# EAGLE design uJOVE7 (EAGLE 9.4.2)

## Sheet 1 of 2
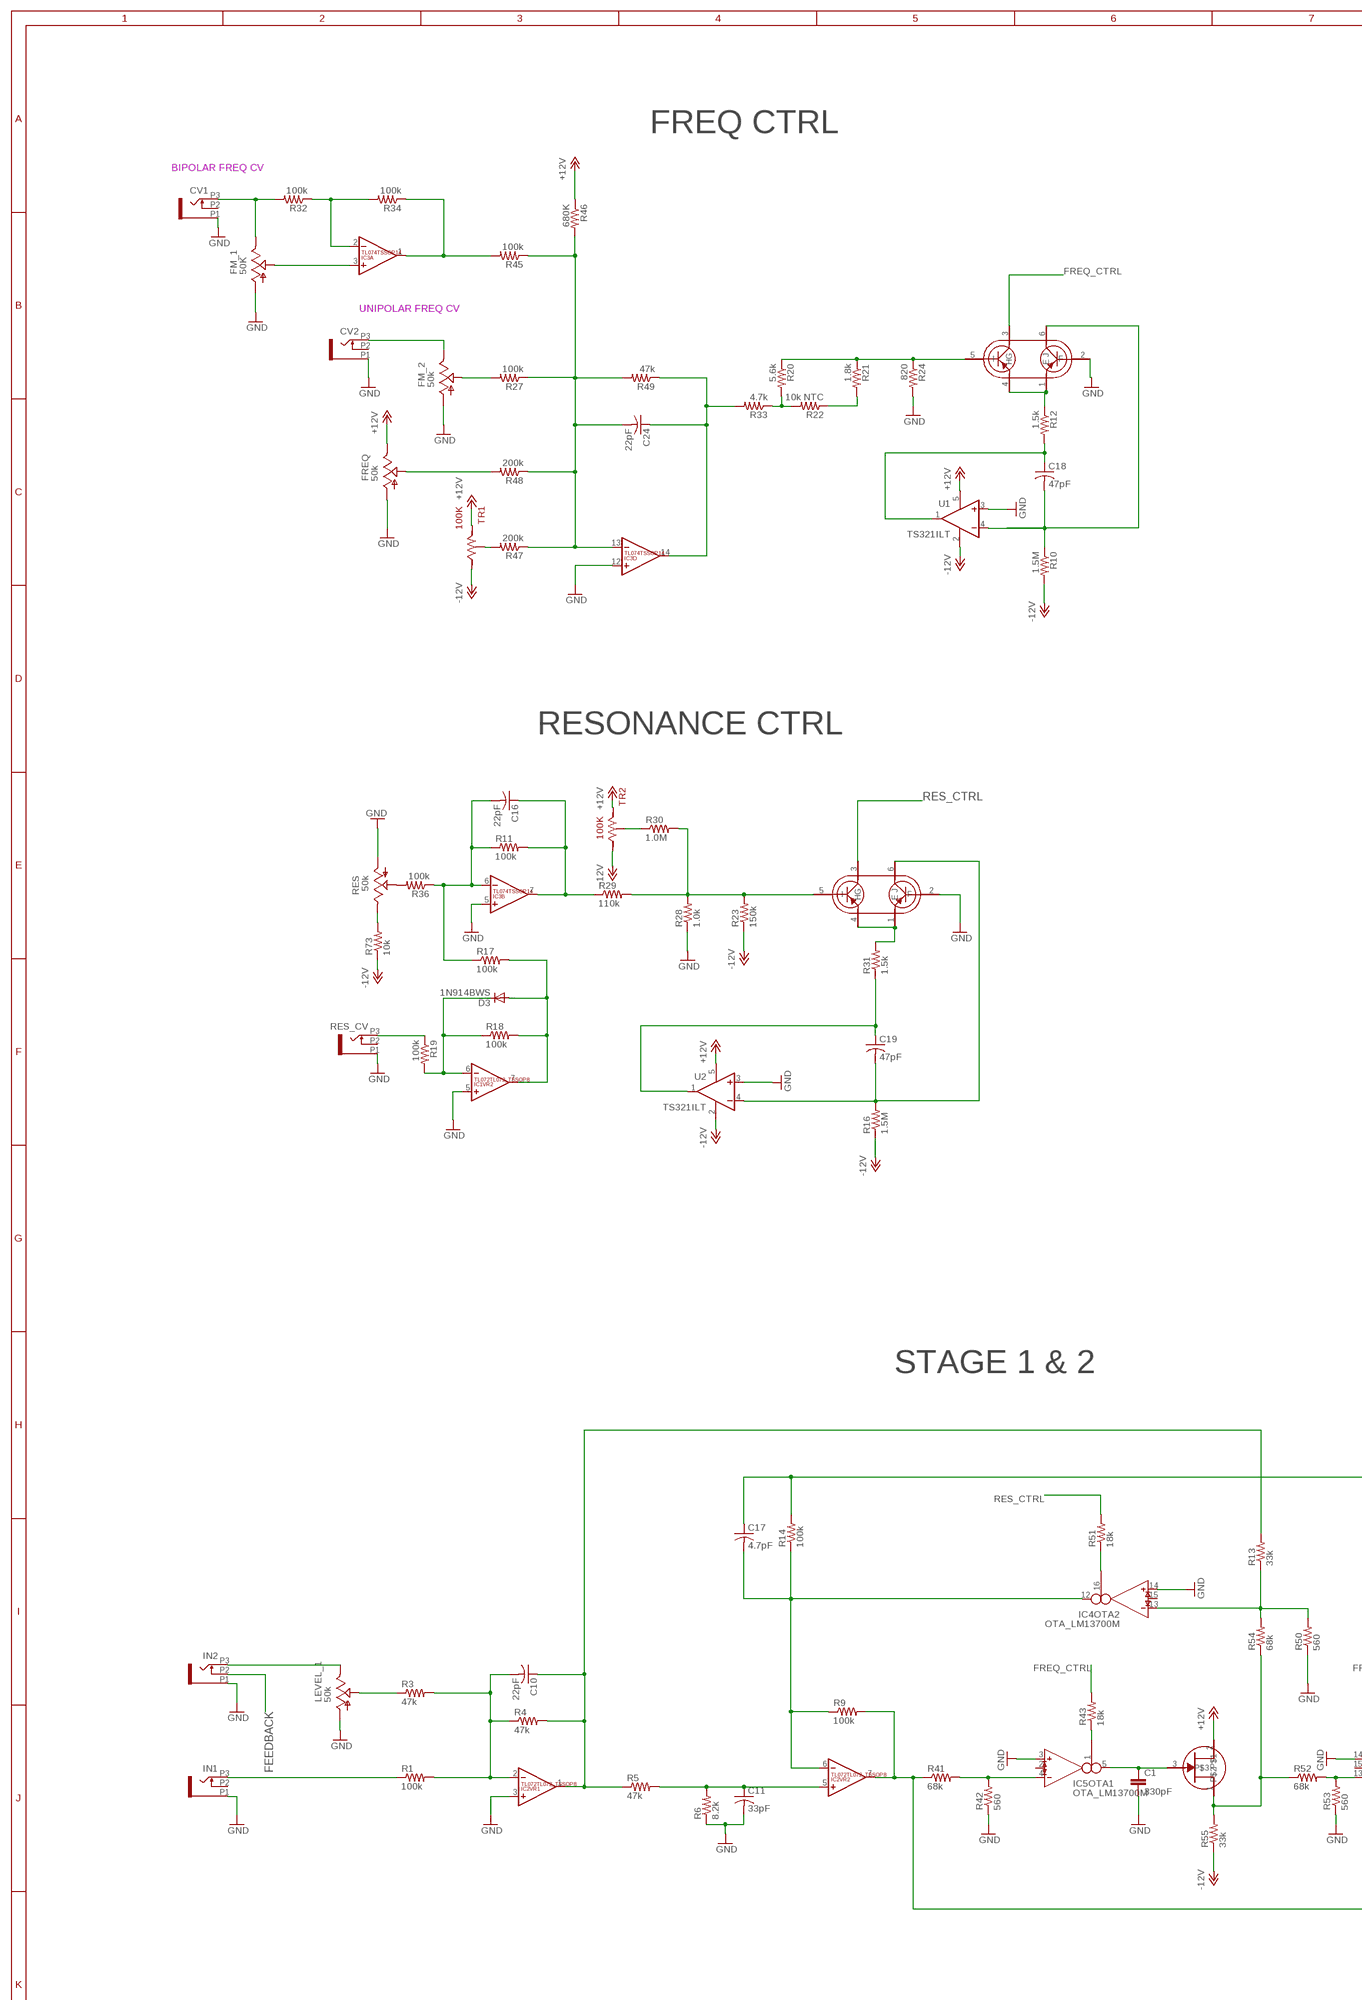
[diagram p0: schematic, sheet 1, part 1 of 3]
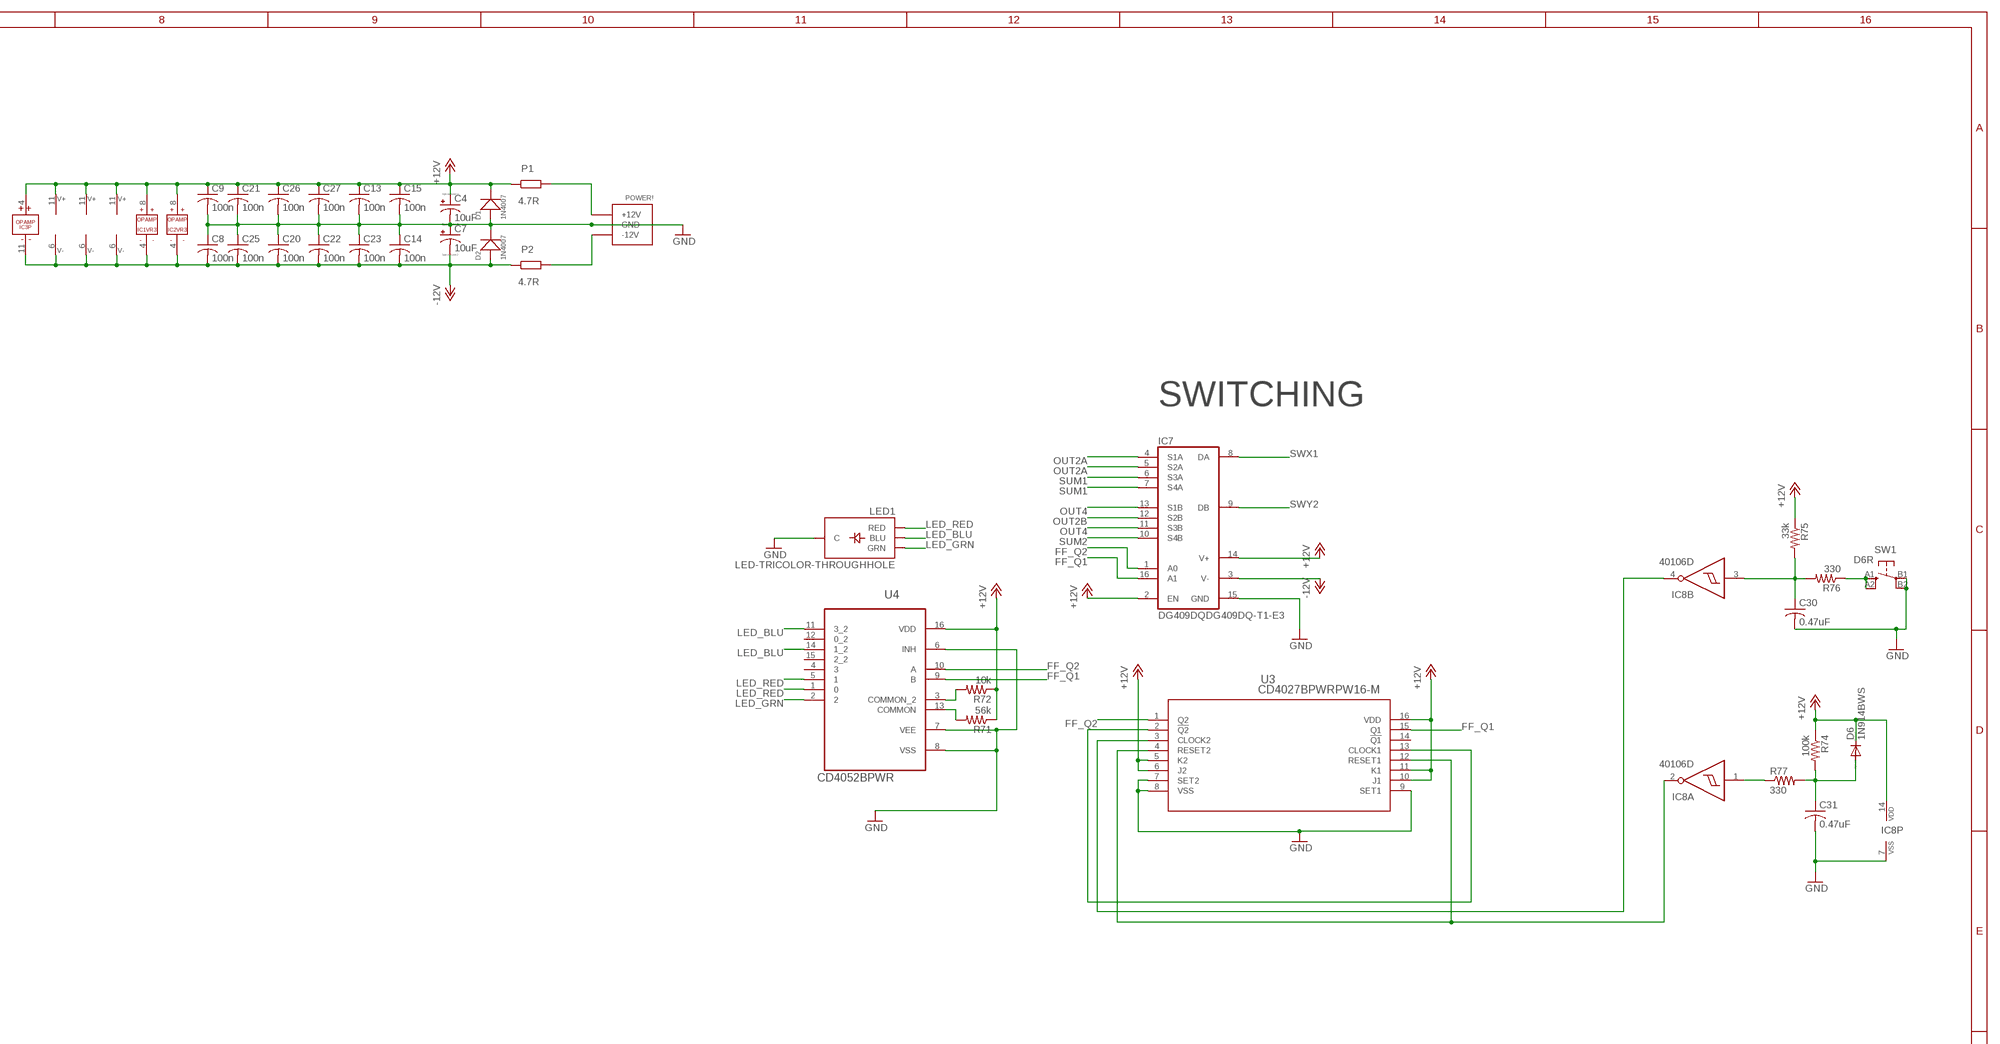
[diagram p1: schematic, sheet 1, part 2 of 3]
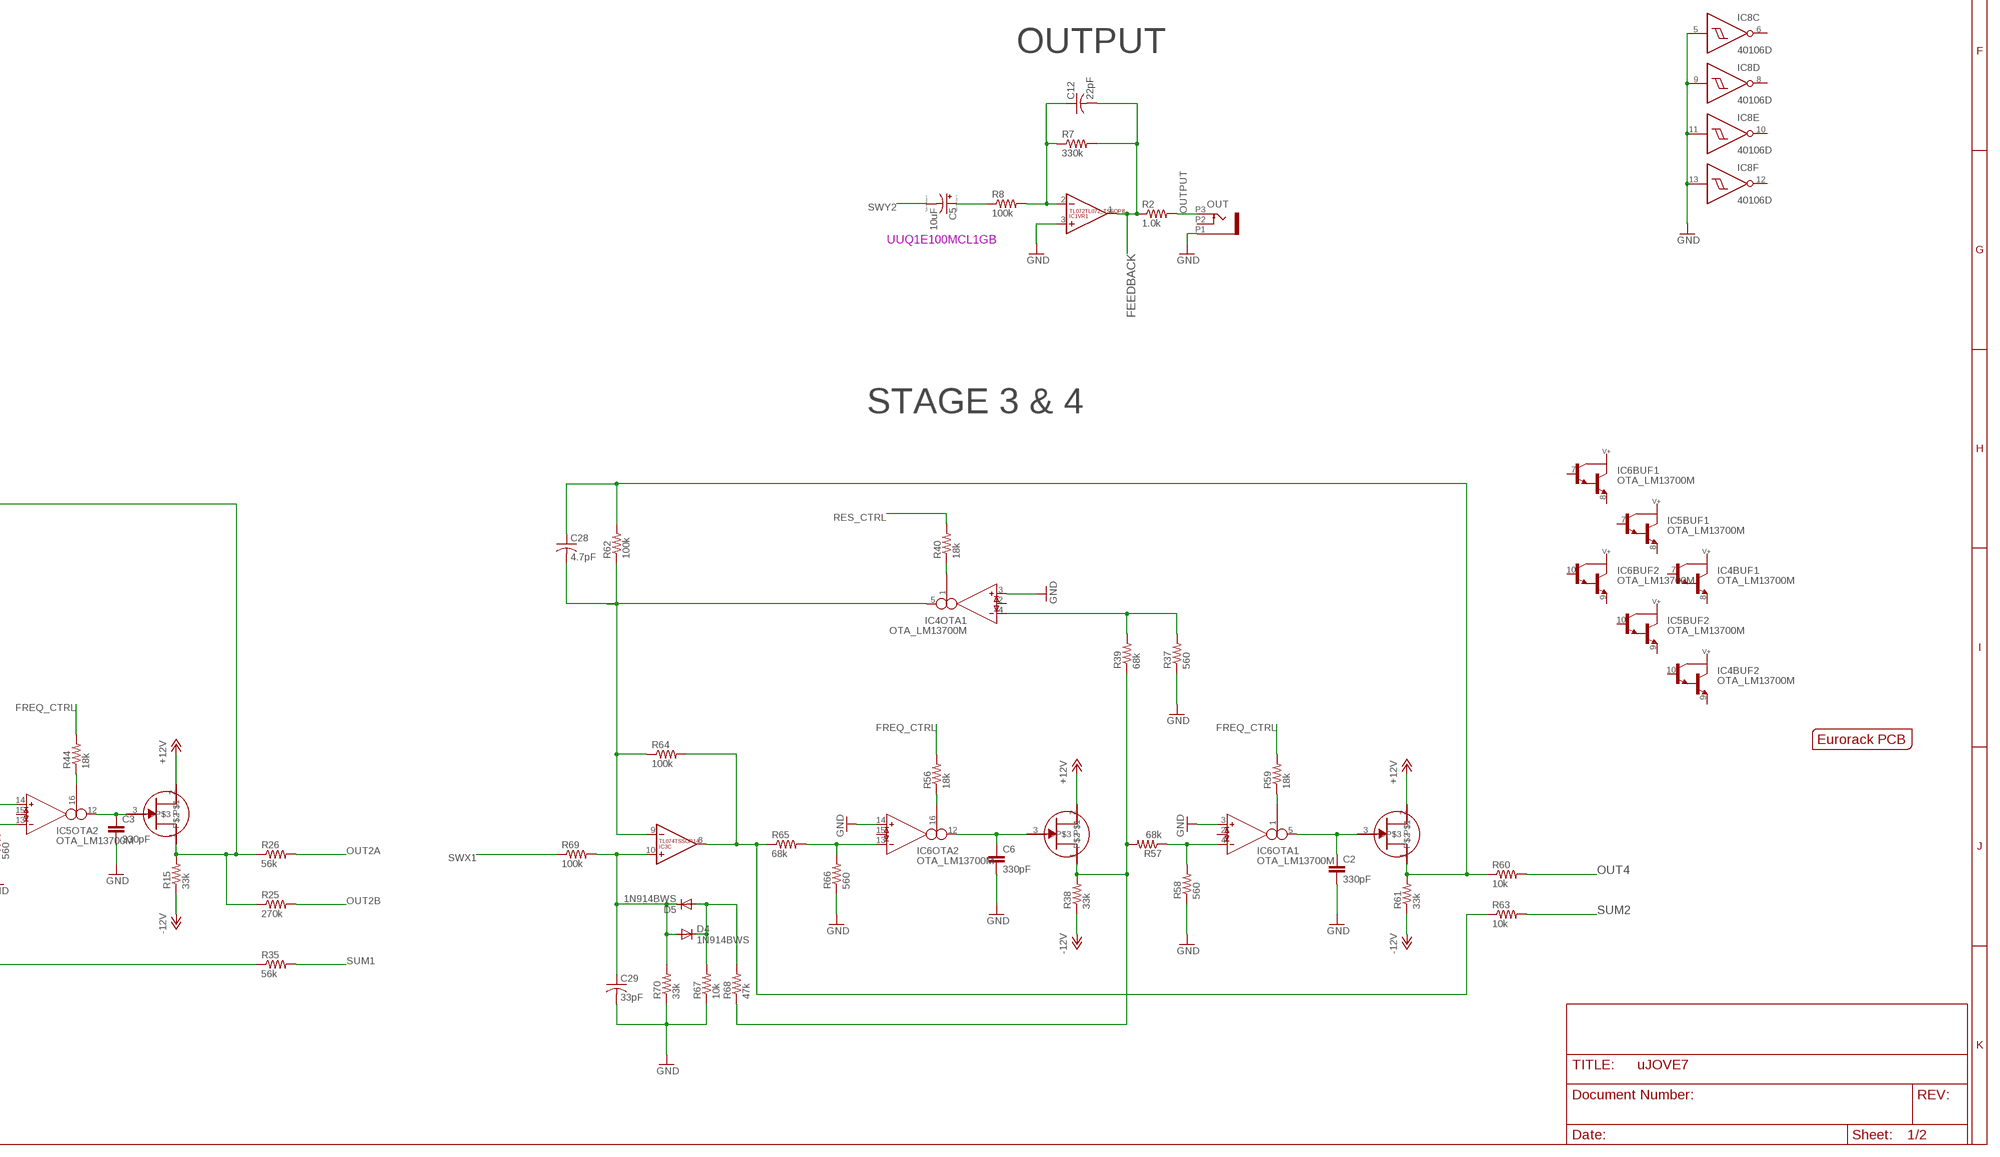
[diagram p2: schematic, sheet 1, part 3 of 3]

### Parts
C1  330pF  C5/5  [C5B5]
C2  330pF  C5/5  [C5B5]
C3  330pF  C5/5  [C5B5]
C4  10uF  CPOL-USC  [PANASONIC_C]
C5  10uF  CPOL-USC  [PANASONIC_C]
C6  330pF  C5/5  [C5B5]
C7  10uF  CPOL-USC  [PANASONIC_C]
C8  100n  C-USC0603  [C0603]
C9  100n  C-USC0603  [C0603]
C10  22pF  C-USC0603  [C0603]
C11  33pF  C-USC0603  [C0603]
C12  22pF  C-USC0603  [C0603]
C13  100n  C-USC0603  [C0603]
C14  100n  C-USC0603  [C0603]
C15  100n  C-USC0603  [C0603]
C16  22pF  C-USC0603  [C0603]
C17  4.7pF  C-USC0603  [C0603]
C18  47pF  C-USC0603  [C0603]
C19  47pF  C-USC0603  [C0603]
C20  100n  C-USC0603  [C0603]
C21  100n  C-USC0603  [C0603]
C22  100n  C-USC0603  [C0603]
C23  100n  C-USC0603  [C0603]
C24  22pF  C-USC0603  [C0603]
C25  100n  C-USC0603  [C0603]
C26  100n  C-USC0603  [C0603]
C27  100n  C-USC0603  [C0603]
C28  4.7pF  C-USC0603  [C0603]
C29  33pF  C-USC0603  [C0603]
C30  0.47uF  C-USC0603  [C0603]
C31  0.47uF  C-USC0603  [C0603]
CV1  OG-PJ301_PJ301_THONKICONN  [OG-PJ301_WQP_PJ_301M6_NO_HOLE]
CV2  OG-PJ301_PJ301_THONKICONN  [OG-PJ301_WQP_PJ_301M6_NO_HOLE]
D1  1N4007  DIODE-GEN-PURPOSE-1KV-1A(DO-214AC)  [DO-214AC]
D2  1N4007  DIODE-GEN-PURPOSE-1KV-1A(DO-214AC)  [DO-214AC]
D3  1N914BWS  DIODE-SOD323-R  [SOD323-R]
D4  1N914BWS  DIODE-SOD323-R  [SOD323-R]
D5  1N914BWS  DIODE-SOD323-R  [SOD323-R]
D6  1N914BWS  DIODE-SOD323-R  [SOD323-R]
FM_1  50K  OG-POTS_POT_USVERTICAL  [OG-POTS_ALPS_POT_VERTICAL]
FM_2  50k  OG-POTS_POT_USVERTICAL  [OG-POTS_ALPS_POT_VERTICAL]
FREQ  50k  OG-POTS_POT_USVERTICAL_PS  [OG-POTS_ALPS_POT_VERTICAL_PS]
IC1  TL072TL072_TSSOP8  [TL072_TSSOP8]
IC2  TL072TL072_TSSOP8  [TL072_TSSOP8]
IC3  TL074TSSOP14  [TSSOP14]
IC4  OTA_LM13700M  [OTA_SO16]
IC5  OTA_LM13700M  [OTA_SO16]
IC6  OTA_LM13700M  [OTA_SO16]
IC7  DG409DQDG409DQ-T1-E3  [TSSOP16]
IC8  40106D  [SO14]
IN1  OG-PJ301_PJ301_THONKICONN  [OG-PJ301_WQP_PJ_301M6_NO_HOLE]
IN2  OG-PJ301_PJ301_THONKICONN  [OG-PJ301_WQP_PJ_301M6_NO_HOLE]
LED1  LED-TRICOLOR-THROUGHHOLE  [LED-TRICOLOR-THROUGHHOLE]
LEVEL_1  50k  OG-POTS_POT_USVERTICAL  [OG-POTS_ALPS_POT_VERTICAL]
OUT  OG-PJ301_PJ301_THONKICONN  [OG-PJ301_WQP_PJ_301M6_NO_HOLE]
P1  4.7R  R-EU_R1206  [R1206]
P2  4.7R  R-EU_R1206  [R1206]
PCB1  EURORACK_PCB  [EURORACK8HPPCB-S]
POWER!  POWER_SIMPLE  [2X05_SMT_HEADER]
Q1  BCM857BS  [SOT65P210X110-6N]
Q2  BCM857BS  [SOT65P210X110-6N]
Q3  MMBFJ112MMBFJ112  [SOT23]
Q4  MMBFJ112MMBFJ112  [SOT23]
Q5  MMBFJ112MMBFJ112  [SOT23]
Q6  MMBFJ112MMBFJ112  [SOT23]
R1  100k  R-US_R0603  [R0603]
R2  1.0k  R-US_R0603  [R0603]
R3  47k  R-US_R0603  [R0603]
R4  47k  R-US_R0603  [R0603]
R5  47k  R-US_R0603  [R0603]
R6  8.2k  R-US_R0603  [R0603]
R7  330k  R-US_R0603  [R0603]
R8  100k  R-US_R0603  [R0603]
R9  100k  R-US_R0603  [R0603]
R10  1.5M  R-US_R0603  [R0603]
R11  100k  R-US_R0603  [R0603]
R12  1.5k  R-US_R0603  [R0603]
R13  33k  R-US_R0603  [R0603]
R14  100k  R-US_R0603  [R0603]
R15  33k  R-US_R0603  [R0603]
R16  1.5M  R-US_R0603  [R0603]
R17  100k  R-US_R0603  [R0603]
R18  100k  R-US_R0603  [R0603]
R19  100k  R-US_R0603  [R0603]
R20  5.6k  R-US_R0603  [R0603]
R21  1.8k  R-US_R0603  [R0603]
R22  10k NTC  R-US_R0805  [R0805]
R23  150k  R-US_R0603  [R0603]
R24  820  R-US_R0603  [R0603]
R25  270k  R-US_R0603  [R0603]
R26  56k  R-US_R0603  [R0603]
R27  100k  R-US_R0603  [R0603]
R28  1.0k  R-US_R0603  [R0603]
R29  110k  R-US_R0603  [R0603]
R30  1.0M  R-US_R0603  [R0603]
R31  1.5k  R-US_R0603  [R0603]
R32  100k  R-US_R0603  [R0603]
R33  4.7k  R-US_R0603  [R0603]
R34  100k  R-US_R0603  [R0603]
R35  56k  R-US_R0603  [R0603]
R36  100k  R-US_R0603  [R0603]
R37  560  R-US_R0603  [R0603]
R38  33k  R-US_R0603  [R0603]
R39  68k  R-US_R0603  [R0603]
R40  18k  R-US_R0603  [R0603]
R41  68k  R-US_R0603  [R0603]
R42  560  R-US_R0603  [R0603]
R43  18k  R-US_R0603  [R0603]
R44  18k  R-US_R0603  [R0603]
R45  100k  R-US_R0603  [R0603]
R46  680K  R-US_R0603  [R0603]
R47  200k  R-US_R0603  [R0603]
R48  200k  R-US_R0603  [R0603]
R49  47k  R-US_R0603  [R0603]
R50  560  R-US_R0603  [R0603]
R51  18k  R-US_R0603  [R0603]
R52  68k  R-US_R0603  [R0603]
R53  560  R-US_R0603  [R0603]
R54  68k  R-US_R0603  [R0603]
R55  33k  R-US_R0603  [R0603]
R56  18k  R-US_R0603  [R0603]
R57  68k  R-US_R0603  [R0603]
R58  560  R-US_R0603  [R0603]
R59  18k  R-US_R0603  [R0603]
R60  10k  R-US_R0603  [R0603]
R61  33k  R-US_R0603  [R0603]
R62  100k  R-US_R0603  [R0603]
R63  10k  R-US_R0603  [R0603]
R64  100k  R-US_R0603  [R0603]
R65  68k  R-US_R0603  [R0603]
R66  560  R-US_R0603  [R0603]
R67  10k  R-US_R0603  [R0603]
R68  47k  R-US_R0603  [R0603]
R69  100k  R-US_R0603  [R0603]
R70  33k  R-US_R0603  [R0603]
R71  56k  R-US_R0603  [R0603]
R72  10k  R-US_R0603  [R0603]
R73  10k  R-US_R0603  [R0603]
R74  100k  R-US_R0603  [R0603]
R75  33k  R-US_R0603  [R0603]
R76  330  R-US_R0603  [R0603]
R77  330  R-US_R0603  [R0603]
RES  50k  OG-POTS_POT_USVERTICAL_PS  [OG-POTS_ALPS_POT_VERTICAL_PS]
RES_CV  OG-PJ301_PJ301_THONKICONN  [OG-PJ301_WQP_PJ_301M6_NO_HOLE]
SW1  D6R  [D6R]
TR1  100K  TC33X-2-104E  [TC33X-2]
TR2  100K  TC33X-2-104E  [TC33X-2]
U1  TS321ILT  TS321IDBV  [SOT23-5]
U2  TS321ILT  TS321IDBV  [SOT23-5]
U3  CD4027BPWRPW16-M  [PW16-M]
U4  CD4052BPWR  [SOP65P640X120-16N]

### Nets
+12V: C4.+ C9.1 C13.1 C15.1 C21.1 C26.1 C27.1 D1.2(-) D6.C FREQ.P$1(E) IC1.8(VR3:V+) IC2.8(VR3:V+) IC3.4(P:V+) IC4.11(SUPPLY:V+) IC5.11(SUPPLY:V+) IC6.11(SUPPLY:V+) IC7.2(EN) IC7.14(V+) IC8.14(P:VDD) P1.1 Q3.2 Q4.2 Q5.2 Q6.2 R46.1 R71.1 R72.1 R74.1 R75.1 TR1.1 TR2.1 U1.5(V+) U2.5(V+) U3.5(K2) U3.6(J2) U3.10(J1) U3.11(K1) U3.16(VDD) U4.16(VDD)
-12V: C7.- C8.2 C14.2 C20.2 C22.2 C23.2 C25.2 D2.1(+) IC1.4(VR3:V-) IC2.4(VR3:V-) IC3.11(P:V-) IC4.6(SUPPLY:V-) IC5.6(SUPPLY:V-) IC6.6(SUPPLY:V-) IC7.3(V-) P2.1 R10.2 R15.1 R16.1 R23.1 R38.1 R55.1 R61.1 R73.1 TR1.3 TR2.3 U1.2(V-) U2.2(V-)
FEEDBACK: C12.2 IC1.1(VR1:OUT) IN2.P2 R2.1 R7.2
FF_Q1: IC7.16(A1) U3.15(Q1) U4.9(B)
FF_Q2: IC7.1(A0) U3.1(Q2) U4.10(A)
FREQ_CTRL: Q1.3(G) R43.2 R44.2 R56.2 R59.2
GND: C1.2 C2.2 C3.2 C4.- C6.2 C7.+ C8.1 C9.2 C11.2 C13.2 C14.1 C15.2 C20.1 C21.2 C22.1 C23.1 C25.1 C26.2 C27.2 C29.2 C30.2 C31.2 CV1.P1 CV2.P1 D1.1(+) D2.2(-) FM_1.P$3(A) FM_2.P$3(A) FREQ.P$3(A) IC1.3(VR1:+IN) IC1.5(VR2:+IN) IC2.3(VR1:+IN) IC3.5(B:+IN) IC3.12(D:+IN) IC4.3(OTA1:IN_P) IC4.14(OTA2:IN_P) IC5.3(OTA1:IN_P) IC5.14(OTA2:IN_P) IC6.3(OTA1:IN_P) IC6.14(OTA2:IN_P) IC7.15(GND) IC8.5(C:I) IC8.7(P:VSS) IC8.9(D:I) IC8.11(E:I) IC8.13(F:I) IN1.P1 IN2.P1 LED1.GND(C) LEVEL_1.P$3(A) OUT.P1 POWER!.3(GND) POWER!.4(GND) POWER!.5(GND) POWER!.6(GND) POWER!.7(GND) POWER!.8(GND) Q1.2(F) Q2.2(F) R6.1 R24.2 R28.1 R37.1 R42.1 R50.1 R53.1 R58.1 R66.1 R67.1 R70.1 RES.P$3(A) RES_CV.P1 SW1.B1(P) SW1.B2(P1) U1.3(+IN) U2.3(+IN) U3.7(SET2) U3.8(VSS) U3.9(SET1) U4.6(INH) U4.7(VEE) U4.8(VSS)
LED_BLU: LED1.BLU U4.11(3_2) U4.14(1_2)
LED_GRN: LED1.GRN U4.2
LED_RED: LED1.RED U4.1 U4.5
N$1: P1.2 POWER!.9(+12V) POWER!.10(+12V)
N$2: P2.2 POWER!.1(-12V) POWER!.2(-12V)
N$3: IN1.P3 R1.1
N$4: C10.2 IC2.2(VR1:-IN) R1.2 R3.2 R4.1
N$5: IN2.P3 LEVEL_1.P$1(E)
N$6: LEVEL_1.P$2(S) R3.1
N$7: C10.1 IC2.1(VR1:OUT) R4.2 R5.1 R13.2
N$8: C11.1 IC2.5(VR2:+IN) R5.2 R6.2
N$9: IC2.7(VR2:OUT) R9.2 R35.1 R41.1
N$10: C17.2 IC2.6(VR2:-IN) IC4.12(OTA2:OUT) R9.1 R14.1
N$11: IC5.4(OTA1:IN_N) R41.2 R42.2
N$12: IC5.1(OTA1:I_BIAS) R43.1
N$13: C1.1 IC5.5(OTA1:OUT) Q4.3
N$14: IC5.13(OTA2:IN_N) R52.2 R53.2
N$15: IC4.13(OTA2:IN_N) R13.1 R50.2 R54.2
N$16: IC4.16(OTA2:I_BIAS) R51.1
N$17: C17.1 Q3.1 R14.2 R15.2 R25.1 R26.1
N$18: Q4.1 R52.1 R54.1 R55.2
N$19: IC5.16(OTA2:I_BIAS) R44.1
N$20: R73.2 RES.P$1(E)
N$21: C3.1 IC5.12(OTA2:OUT) Q3.3
N$22: C5.+ R8.1
N$23: C12.1 IC1.2(VR1:-IN) R7.1 R8.2
N$24: C31.1 D6.A R74.2 R77.2
N$25: IC3.8(C:OUT) R63.1 R64.2 R65.1
N$26: IC6.4(OTA1:IN_N) R57.1 R58.2
N$27: D4.C D5.A R67.2 R68.2
N$28: C29.1 D4.A D5.C IC3.10(C:+IN) R69.2 R70.2
N$29: IC6.13(OTA2:IN_N) R65.2 R66.2
N$30: IC4.4(OTA1:IN_N) R37.2 R39.2
N$31: IC6.16(OTA2:I_BIAS) R56.1
N$32: C6.1 IC6.12(OTA2:OUT) Q6.3
N$33: Q6.1 R38.2 R39.1 R57.2 R68.1
N$34: IC4.1(OTA1:I_BIAS) R40.1
N$35: C28.2 IC3.9(C:-IN) IC4.5(OTA1:OUT) R62.1 R64.1
N$36: R36.2 RES.P$2(S)
N$37: IC6.1(OTA1:I_BIAS) R59.1
N$38: C28.1 Q5.1 R60.1 R61.2 R62.2
N$39: C2.1 IC6.5(OTA1:OUT) Q5.3
N$40: R19.1 RES_CV.P3
N$41: D3.C IC1.6(VR2:-IN) R18.1 R19.2
N$42: D3.A IC1.7(VR2:OUT) R17.2 R18.2
N$43: C16.2 IC3.6(B:-IN) R11.1 R17.1 R36.1
N$44: R30.1 TR2.2
N$45: C16.1 IC3.7(B:OUT) R11.2 R29.1
N$46: Q2.5(I) R23.2 R28.2 R29.2 R30.2
N$47: Q2.1(E) Q2.4(H) R31.2
N$48: C19.2 Q2.6(J) R16.2 U2.4(-IN)
N$49: C19.1 R31.1 U2.1(OUT)
N$50: CV1.P3 FM_1.P$1(E) R32.2
N$51: IC3.2(A:-IN) R32.1 R34.2
N$52: FM_1.P$2(S) IC3.3(A:+IN)
N$53: IC3.1(A:OUT) R34.1 R45.2
N$54: C24.2 IC3.13(D:-IN) R27.1 R45.1 R46.2 R47.1 R48.1 R49.2
N$55: CV2.P3 FM_2.P$1(E)
N$56: FM_2.P$2(S) R27.2
N$57: FREQ.P$2(S) R48.2
N$58: R47.2 TR1.2
N$59: C24.1 IC3.14(D:OUT) R33.2 R49.1
N$60: R20.2 R22.2 R33.1
N$61: Q1.5(I) R20.1 R21.1 R24.1
N$62: R21.2 R22.1
N$63: C18.2 Q1.6(J) R10.1 U1.4(-IN)
N$64: Q1.1(E) Q1.4(H) R12.1
N$65: C18.1 R12.2 U1.1(OUT)
N$66: IC8.1(A:I) R77.1
N$67: C30.1 IC8.3(B:I) R75.2 R76.2
N$68: IC8.2(A:O) U3.4(RESET2) U3.12(RESET1)
N$70: IC8.4(B:O) U3.3(CLOCK2)
N$71: R76.1 SW1.A1(S) SW1.A2(S1)
N$72: U3.2(!Q2) U3.13(CLOCK1)
N$73: R72.2 U4.3(COMMON_2)
N$74: R71.2 U4.13(COMMON)
OUT2A: IC7.4(S1A) IC7.5(S2A) R26.2
OUT2B: IC7.12(S2B) R25.2
OUT4: IC7.11(S3B) IC7.13(S1B) R60.2
OUTPUT: OUT.P3 R2.2
RES_CTRL: Q2.3(G) R40.2 R51.2
SUM1: IC7.6(S3A) IC7.7(S4A) R35.2
SUM2: IC7.10(S4B) R63.2
SWX1: IC7.8(DA) R69.1
SWY2: C5.- IC7.9(DB)
Unconnected: CV1.P2 CV2.P2 IC4.2(OTA1:I_DIODE) IC4.7(BUF1:B) IC4.8(BUF1:E) IC4.9(BUF2:E) IC4.10(BUF2:B) IC4.15(OTA2:I_DIODE) IC5.2(OTA1:I_DIODE) IC5.7(BUF1:B) IC5.8(BUF1:E) IC5.9(BUF2:E) IC5.10(BUF2:B) IC5.15(OTA2:I_DIODE) IC6.2(OTA1:I_DIODE) IC6.7(BUF1:B) IC6.8(BUF1:E) IC6.9(BUF2:E) IC6.10(BUF2:B) IC6.15(OTA2:I_DIODE) IC8.6(C:O) IC8.8(D:O) IC8.10(E:O) IC8.12(F:O) IN1.P2 OUT.P2 RES_CV.P2 U3.14(!Q1) U4.4 U4.12(0_2) U4.15(2_2)

### Notes on the sheet
- FREQ CTRL
- BIPOLAR FREQ CV
- UNIPOLAR FREQ CV
- SWITCHING
- RESONANCE CTRL
- OUTPUT
- UUQ1E100MCL1GB
- STAGE 1 & 2
- STAGE 3 & 4

## Sheet 2 of 2

## Library data of the parts
C1-C3 C6 = capacitor-wima:C: CAPACITOR naming: grid - package width
C4 C5 C7 = resistor:CPOL-US: POLARIZED CAPACITOR, American symbol
C8-C31 = resistor:C-US: CAPACITOR, American symbol
CV1 CV2 IN1 IN2 OUT RES_CV = SHAY_THONKICONNS:OG-PJ301_PJ301_THONKICONN
D1 D2 = Seeed-Diode:DIODE-GEN-PURPOSE-1KV-1A(DO-214AC): 304010013; MPN: 1N4007
D3-D6 = diode:DIODE-: DIODE
FM_1 FM_2 FREQ LEVEL_1 RES = elements_v02:OG-POTS_POT_US
IC1 IC2 = EurorackModularParts:TL072
IC3 = EurorackModularParts:TL074: OP AMP
IC4-IC6 = wavelet6:OTA_LM13700: Dual OTA with buffers
IC7 = maxim:DG409DQ: ANALOG MULTIPLEXER
IC8 = 40xx:40106: Hex SCHMITT TRIGGER
LED1 = og-leds:LED-TRICOLOR-THROUGHHOLE
P1 P2 = rcl:R-EU_: RESISTOR, European symbol; SPICEPREFIX: R
PCB1 = EurorackModularParts:EURORACK_PCB
POWER! = EurorackModularParts:POWER_SIMPLE
Q1 Q2 = BCM857BS:BCM857BS: NEXPERIA - BCM857BS - TRANSISTOR, MATCHED, SOT-363 Source: Datasheet <https://assets.nexperia.com/documents/data-sheet/BCM857BV_BS_DS.pdf>; ARROW_PART_NUMBER: BCM857BS; DESCRIPTION: NEXPERIA - BCM857BS - TRANSISTOR, MATCHED, SOT-363; HEIGHT: 1.1mm; MANUFACTURER_NAME: Nexperia; MANUFACTURER_PART_NUMBER: BCM857BS
Q3-Q6 = MMBFJ112:MMBFJ112
R1-R21 R23-R77 = rcl:R-US_: RESISTOR, American symbol; SPICEPREFIX: R
R22 = resistor:R-US_: RESISTOR, American symbol
SW1 = og-switch:D6R: C&K D6R
TR1 TR2 = TC33X-2-104E:TC33X-2-104E: Cermet 3mm SMT trimmer,0.1W 100k Bourns TC33 Series SMD Cermet Trimmer Resistor with Solder Pad Terminations, 100k 25% 1/10W 250ppm/C Top Adjust Source: Datasheet <http://www.bourns.com/docs/Product-Datasheets/TC33.pdf>; ALLIED_NUMBER: 70155236; ALLIED_PRICE-STOCK: https://www.alliedelec.com/bourns-tc33x-2-104e/70155236/; ARROW_PART_NUMBER: TC33X-2-104E; ARROW_PRICE-STOCK: https://www.arrow.com/en/products/tc33x-2-104e/bourns; DESCRIPTION: Cermet 3mm SMT trimmer,0.1W 100k Bourns TC33 Series SMD Cermet Trimmer Resistor with Solder Pad Terminations, 100k 25% 1/10W 250ppm/C Top Adjust; HEIGHT: mm; MANUFACTURER_NAME: Bourns; MANUFACTURER_PART_NUMBER: TC33X-2-104E; RS_PART_NUMBER: 1673550; RS_PRICE-STOCK: http://uk.rs-online.com/web/p/products/1673550
U1 U2 = TS321I:TS321I; AVAILABILITY: Unavailable; MF: STMicroelectronics; MP: TS321I; PACKAGE: None; PRICE: None
U3 = CD4027BPWR:CD4027BPWR; MANUFACTURER_PART_NUMBER: CD4027BPWR; VENDOR: Vendor
U4 = CD4052BPWR:CD4052BPWR: single 8-Channel multiplexer; AVAILABILITY: Unavailable; DESCRIPTION: CMOS Differential 4-Channel Analog Multiplexer/Demultiplexer with Logic-Level Conversion 16-TSSOP -55 to 125; MF: Texas Instruments; MP: CD4052BPWR; PACKAGE: TSSOP-16 Texas Instruments; PRICE: None

## Board
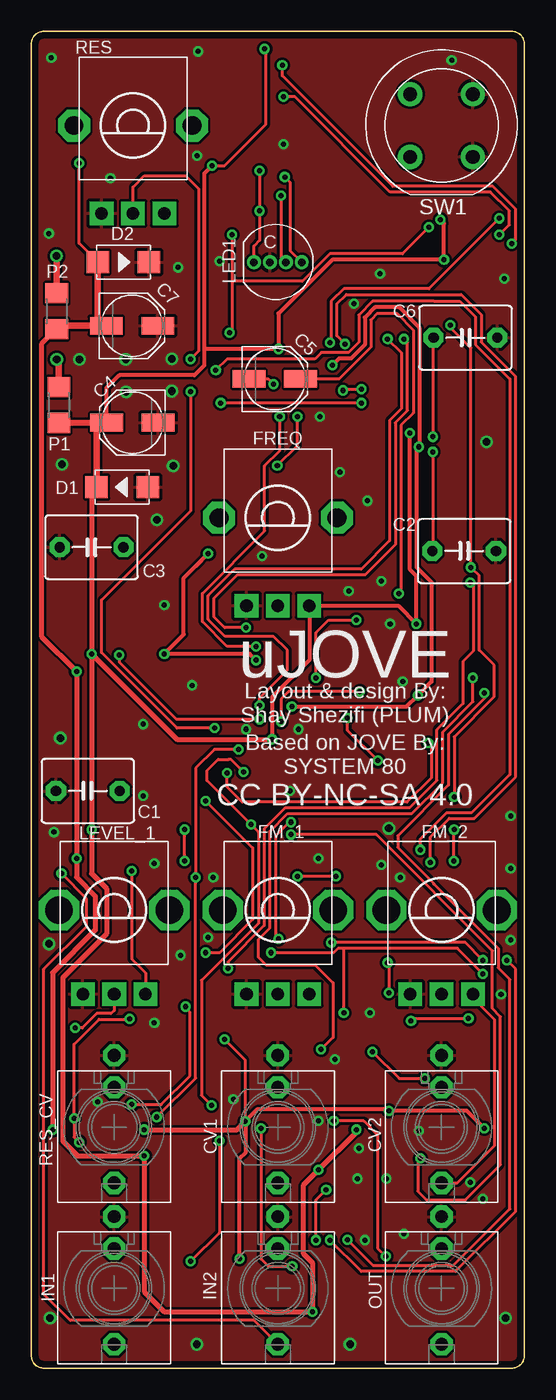
[diagram p3: board, top side]
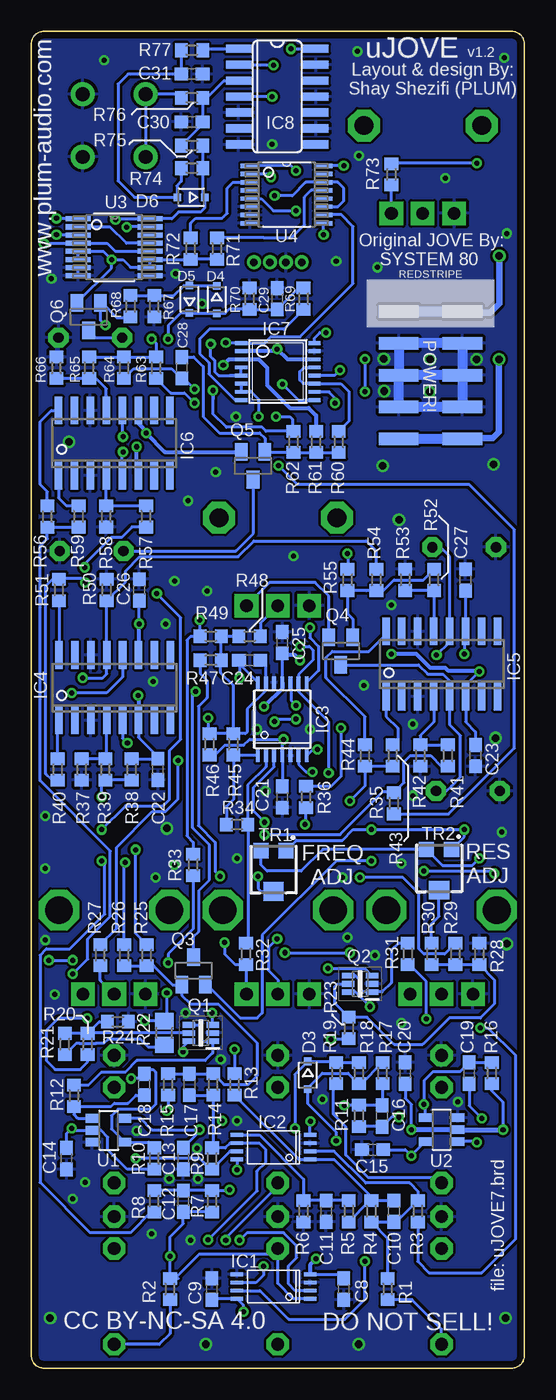
[diagram p4: board, bottom side, seen from below]

Size 39.3 x 106.5 mm. Coordinates in mm from the lower left corner, seen from the top.
Copper layers (1*16): Top 0.035mm / dielectric 1.5mm / Bottom 0.035mm
Design rules "default *": minimum track width 10mil, minimum drill 0.4mm, track to track 8mil, track to pad 6mil, pad to pad 6mil, via to via 6mil, smd to smd 6mil, copper to edge 20mil, drill to drill 6mil, minimum pad ring 10mil, minimum via ring 8mil, stop-mask expansion 4mil, vias tented up to drill 25mil, thermal gap 10mil

### Footprints (pad centres in the part's own frame; a part is rotated, then mirrored left to right if it is on the bottom)
C5B5 = drill 0.813 pad 1.6 octagon: 1 -2.54,0; 2 2.54,0
PANASONIC_C = smd 2.6 x 1.4: + 2.05,0; - -2.05,0
C0603 = smd 1.1 x 1: 1 -0.85,0; 2 0.85,0
OG-PJ301_WQP_PJ_301M6_NO_HOLE = drill 1.016 pad 1.778 octagon: P1 0,-5.715; P2 0,-3.175; P3 0,4.445
DO-214AC = smd 1.8 x 1.77: 1 -2.042,0; 2 2.042,0
SOD323-R = smd 0.6 x 0.6: A 1.1,0; C -1.1,0
OG-POTS_ALPS_POT_VERTICAL = drill 1 pad 1.88 square: P$1 -2.5,6.7; P$2 0,6.7; P$3 2.5,6.7 | drill 2.2 pad 3.175 octagon: P$4 -4.4,0; P$5 4.4,0
OG-POTS_ALPS_POT_VERTICAL_PS = drill 1 pad 1.88 square: P$1 -2.5,7; P$2 0,7; P$3 2.5,7 | drill 1.5 pad 2.54 octagon: P$4 -4.7,0; P$5 4.7,0
TL072_TSSOP8 = smd 0.305 x 0.991: 1 -0.975,-2.918; 2 -0.325,-2.918; 3 0.325,-2.918; 4 0.975,-2.918; 5 0.975,2.918; 6 0.325,2.918; 7 -0.325,2.918; 8 -0.975,2.918
TSSOP14 = smd 0.305 x 0.991: 1 -1.95,-2.918; 2 -1.3,-2.918; 3 -0.65,-2.918; 4 0,-2.918; 5 0.65,-2.918; 6 1.3,-2.918; 7 1.95,-2.918; 8 1.95,2.918; 9 1.3,2.918; 10 0.65,2.918; 11 0,2.918; 12 -0.65,2.918; 13 -1.3,2.918; 14 -1.95,2.918
OTA_SO16 = smd 0.6 x 2.2: 1 -4.445,-2.6; 2 -3.175,-2.6; 3 -1.905,-2.6; 4 -0.635,-2.6; 5 0.635,-2.6; 6 1.905,-2.6; 7 3.175,-2.6; 8 4.445,-2.6; 9 4.445,2.6; 10 3.175,2.6; 11 1.905,2.6; 12 0.635,2.6; 13 -0.635,2.6; 14 -1.905,2.6; 15 -3.175,2.6; 16 -4.445,2.6
TSSOP16 = smd 0.305 x 0.991: 1 -2.275,-2.918; 2 -1.625,-2.918; 3 -0.975,-2.918; 4 -0.325,-2.918; 5 0.325,-2.918; 6 0.975,-2.918; 7 1.625,-2.918; 8 2.275,-2.918; 9 2.275,2.918; 10 1.625,2.918; 11 0.975,2.918; 12 0.325,2.918; 13 -0.325,2.918; 14 -0.975,2.918; 15 -1.625,2.918; 16 -2.275,2.918
SO14 = smd 0.66 x 2.032: 1 -3.81,-3.073; 2 -2.54,-3.073; 3 -1.27,-3.073; 4 0,-3.073; 5 1.27,-3.073; 6 2.54,-3.073; 7 3.81,-3.073; 8 3.81,3.073; 9 2.54,3.073; 10 1.27,3.073; 11 0,3.073; 12 -1.27,3.073; 13 -2.54,3.073; 14 -3.81,3.073
LED-TRICOLOR-THROUGHHOLE = drill 0.6: BLU 0.635,0; GND -0.635,0; GRN 1.905,0; RED -1.905,0
R1206 = smd 1.6 x 1.803: 1 -1.422,0; 2 1.422,0
2X05_SMT_HEADER = smd 1 x 3.17: 1 -5.08,-2.54; 2 -5.08,2.54; 3 -2.54,-2.54; 4 -2.54,2.54; 5 0,-2.54; 6 0,2.54; 7 2.54,-2.54; 8 2.54,2.54; 9 5.08,-2.54; 10 5.08,2.54
SOT65P210X110-6N = smd 1 x 0.45: 1 -0.95,0.65; 2 -0.95,0; 3 -0.95,-0.65; 4 0.95,-0.65; 5 0.95,0; 6 0.95,0.65
SOT23 = smd 1 x 1.4: 1 -0.95,-1.1; 2 0.95,-1.1; 3 0,1.1
R0603 = smd 1 x 1.1: 1 -0.85,0; 2 0.85,0
R0805 = smd 1.3 x 1.5: 1 -0.95,0; 2 0.95,0
D6R = drill 1.1 pad 1.93: A1 -2.5,2.5; A2 2.5,2.5; B1 -2.5,-2.5; B2 2.5,-2.5
TC33X-2 = smd 1.2 x 1.2: 1 -1,-1.625; 3 1,-1.625 | smd 1.6 x 1.5: 2 0,1.625
SOT23-5 = smd 0.69 x 0.99: 1 -0.95,-1.306; 2 0,-1.306; 3 0.95,-1.306; 4 0.95,1.306; 5 -0.95,1.306
PW16-M = smd 1.981 x 0.406: 1 -2.87,2.275; 2 -2.87,1.625; 3 -2.87,0.975; 4 -2.87,0.325; 5 -2.87,-0.325; 6 -2.87,-0.975; 7 -2.87,-1.625; 8 -2.87,-2.275; 9 2.87,-2.275; 10 2.87,-1.625; 11 2.87,-0.975; 12 2.87,-0.325; 13 2.87,0.325; 14 2.87,0.975; 15 2.87,1.625; 16 2.87,2.275
SOP65P640X120-16N = smd 1.473 x 0.356: 1 -2.921,2.286; 2 -2.921,1.626; 3 -2.921,0.965; 4 -2.921,0.33; 5 -2.921,-0.33; 6 -2.921,-0.965; 7 -2.921,-1.626; 8 -2.921,-2.286; 9 2.921,-2.286; 10 2.921,-1.626; 11 2.921,-0.965; 12 2.921,-0.33; 13 2.921,0.33; 14 2.921,0.965; 15 2.921,1.626; 16 2.921,2.286

### Placement (x,y rotation side)
C1  4.5,45.99 180 top
C2  34.5,65.1 0 top
C3  4.8,65.4 180 top
C4  8.05,75.33 180 top
C5  19.4,78.8 0 top
C6  34.6,82.1 0 top
C7  8.02,83.04 0 top
C8  14.4,6.3 90 bottom
C9  24.9,6.3 90 bottom
C10  10.4,12.5 270 bottom
C11  15.8,12.5 270 bottom
C12  27.2,13.3 270 bottom
C13  27.2,16.7 270 bottom
C14  36.5,16.7 90 bottom
C15  12.1,17.4 180 bottom
C16  11.35,20.08 90 bottom
C17  26.7,22.6 270 bottom
C18  30.3,22.6 90 bottom
C19  4.4,23.5 90 bottom
C20  9.5,23.5 270 bottom
C21  19.3,45.5 270 bottom
C22  29.2,47.7 90 bottom
C23  3.9,48.8 90 bottom
C24  21.9,56.4 0 bottom
C25  19.3,57.8 270 bottom
C26  30.7,62 90 bottom
C27  4.7,62.8 90 bottom
C28  27.3,79.7 270 bottom
C29  19.7,85.2 90 bottom
C30  26.5,99.3 180 bottom
C31  26.5,103.1 0 bottom
CV1  19.65,19.2 180 top
CV2  32.7,19.2 180 top
D1  7.24,70.19 180 top
D2  7.34,88.11 0 top
D3  17.26,23.34 270 bottom
D4  24.52,85.14 270 bottom
D5  26.7,85.16 90 bottom
D6  26.56,93.28 180 bottom
FM_1  19.65,36.5 180 top
FM_2  32.7,36.5 180 top
FREQ  19.65,67.75 180 top
IC1  20,6.5 90 bottom
IC2  20,17.6 90 bottom
IC3  19.3,51.7 0 bottom
IC4  32.66,54.21 0 bottom
IC5  6.59,56.1 0 bottom
IC6  32.69,73.7 0 bottom
IC7  19.65,79.4 270 bottom
IC8  19.7,101.3 270 bottom
IN1  6.6,6.35 180 top
IN2  19.65,6.35 180 top
LED1  19.65,88.1 0 top
LEVEL_1  6.6,36.5 180 top
OUT  32.7,6.35 180 top
P1  2.19,76.73 90 top
P2  2.02,84.21 90 top
PCB1  -0.5,0 0 top
POWER!  7.48,79.11 270 bottom
Q1  25.8,26.7 180 bottom
Q2  13.09,30.61 180 bottom
Q3  26.37,31.65 0 bottom
Q4  14.63,57.13 180 bottom
Q5  21.63,71.89 180 bottom
Q6  34.73,83.77 180 bottom
R1  10.9,6.3 90 bottom
R2  28.25,6.3 270 bottom
R3  8.5,12.5 90 bottom
R4  12.2,12.5 90 bottom
R5  14,12.5 90 bottom
R6  17.6,12.5 90 bottom
R7  24.9,13.3 270 bottom
R8  29.5,13.3 90 bottom
R9  24.9,16.7 270 bottom
R10  29.5,16.7 270 bottom
R11  13.2,20.1 270 bottom
R12  35.9,21.7 270 bottom
R13  23.1,22.6 270 bottom
R14  24.8,22.6 90 bottom
R15  28.4,22.6 90 bottom
R16  2.6,23.5 90 bottom
R17  11.3,23.5 90 bottom
R18  13.2,23.5 270 bottom
R19  15,23.5 90 bottom
R20  34.82,25.82 270 bottom
R21  36.63,25.82 270 bottom
R22  28.7,26.7 90 bottom
R23  14,27.1 90 bottom
R24  32.4,27.6 0 bottom
R25  30.1,32.9 90 bottom
R26  31.9,32.9 90 bottom
R27  33.8,32.9 270 bottom
R28  3.6,33 270 bottom
R29  5.5,33 270 bottom
R30  7.4,33 270 bottom
R31  9.3,33 90 bottom
R32  22.2,33 270 bottom
R33  26.4,40.1 90 bottom
R34  22.9,43.3 0 bottom
R35  10.4,45 270 bottom
R36  17.4,45.5 90 bottom
R37  35.28,47.69 90 bottom
R38  31.3,47.7 270 bottom
R39  33.4,47.7 90 bottom
R40  37.2,47.7 270 bottom
R41  6.1,48.8 90 bottom
R42  8.3,48.8 90 bottom
R43  10.5,48.8 270 bottom
R44  12.7,48.8 270 bottom
R45  23.2,49.7 270 bottom
R46  25.1,49.7 90 bottom
R47  25,56.4 180 bottom
R48  21.9,58.3 0 bottom
R49  25,58.3 0 bottom
R50  33.3,62 270 bottom
R51  37.1,62 90 bottom
R52  7.2,62.8 270 bottom
R53  9.5,62.8 270 bottom
R54  11.8,62.8 90 bottom
R55  14.1,62.8 270 bottom
R56  38.02,67.85 270 bottom
R57  30.16,67.86 270 bottom
R58  33.33,67.86 90 bottom
R59  35.54,67.86 270 bottom
R60  14.8,73.8 90 bottom
R61  16.6,73.8 270 bottom
R62  18.4,73.8 270 bottom
R63  29.35,79.7 270 bottom
R64  31.92,79.7 90 bottom
R65  34.7,79.7 270 bottom
R66  37.3,79.7 270 bottom
R67  29.5,84.6 90 bottom
R68  31.4,84.6 90 bottom
R69  17.6,85.2 90 bottom
R70  21.9,85.2 270 bottom
R71  24.5,89.2 90 bottom
R72  26.6,89.2 90 bottom
R73  10.6,95.1 270 bottom
R74  26.5,95.6 180 bottom
R75  26.5,97.4 180 bottom
R76  26.5,101.2 0 bottom
R77  26.5,105 180 bottom
RES  8.1,99 180 top
RES_CV  6.6,19.2 180 top
SW1  32.7,99 90 top
TR1  20,39.6 180 bottom
TR2  6.8,39.7 180 bottom
U1  33.15,18.95 270 bottom
U2  6.6,19 90 bottom
U3  32.7,89.3 0 bottom
U4  18.95,93.5 0 bottom

### Tracks (layer width: path | path; a pad name or v marks a point on that pad's centre or on a via)
+12V  (via drill 0.4)
  Top 0.254: 30.18,74.46 v30.16,74.48 | v12.2,40.4 v12.2,42.9 | v14.4,95.8 15.4,95.8 18.7,99.1 18.7,105 v18.6,105.1
  Top 0.305: C4.+ 6,78.1 7,79.1 13,79.1 13.8,79.9 13.8,81.1 | v32.6,91.5 32.9,91.2 v32.9,88.3 23.98,88.3 19.7,84.02 v19.7,81.2 13.9,81.2 13.8,81.1 | v14.4,95.8 13.8,95.2 13.8,81.1 | v19.2,50.1 19.2,53.45 22.15,56.4 FREQ.P$1 29.25,60.75 v30.7,59.3 30.7,63.11 30.19,63.62 30.19,74.45 30.18,74.46
  Top 0.406: D1.2 4.8,69.79 v4.8,56.9 | v4.8,56.9 11.6,50.1 v19.2,50.1 | v4.8,56.9 v4.8,42.9 4.8,39.4 6,38.2 6,34.6 2.5,31.1 2.5,18.1 3.7,16.9 v9,16.9 9,6.1 10.6,4.5 v22.4,4.5 22.4,8.4 21.7,9.1 21.7,14.6 v22.9,15.8 25.9,18.8 v25.9,19
  Top 0.508: P1.1 C4.+ 5.2,74.53 D1.2
  Bottom 0.254: U3.10 29.83,87.7 | 29.83,87.7 U3.11 26.62,88.33 R72.1 R71.1 | U3.6 U3.5 | 29.83,87.7 31.4,87.7 32,88.3 v32.9,88.3 | 35.49,88.9 U3.5 | v14.4,95.8 16.02,95.8 U4.16 | U2.5 9,16.96 v9,16.9 9.5,17.4 C15.1 | 30.75,59.24 v30.7,59.3 C26.1 | C21.1 IC3.4 19.3,50 | 19.3,50 v19.2,50.1 | TR2.1 4.8,42.33 v4.8,42.9 v12.2,42.9 13.65,42.9 14.51,42.04 18.18,42.04 TR1.1 | v32.6,91.5 32.52,91.58 U3.16 28.1,91.58 27.57,92.1 25.8,92.1 25.46,92.44 25.46,93.2 | C13.1 25.9,18.85 v25.9,19 29.7,19 30.6,19.9 U1.5 | FREQ.P$1 20.3,62.6 16.68,62.6 15.58,61.5 Q4.2 | C27.1 4.7,58.72 IC5.11 4.8,58.59 v4.8,56.9 | Q6.2 32.9,87.65 v32.9,88.3 | R46.1 24.64,48.85 23.87,49.63 22.37,49.63 21.9,50.1 19.4,50.1 19.3,50 | v12.2,40.4 15,40.4 20.9,34.5 20.9,28.3 21.3,27.9 22.65,27.9 25.3,30.55 Q3.2 | U3.5 33.58,88.97 v32.9,88.3 | 25.46,93.2 D6.C | 25.46,93.2 25.65,93.39 R74.1 R75.1 | v18.6,105.1 IC8.14 | IC2.8 22.92,15.82 v22.9,15.8 | v22.4,4.5 22.4,5.01 IC1.8 24.82,5.53 C9.1
  Bottom 0.305: 30.75,59.24 IC4.11 | IC6.11 30.79,75.28 30.16,74.66 v30.16,74.48 28.67,72.99 Q5.2 | IC7.2 19.88,81.03 v19.7,81.2 18.88,80.38 IC7.14 | 16.62,105.1 IC8.14
-12V  (via drill 0.4)
  Top 0.254: v15.4,26.2 17.05,24.55 v17.05,19.65 | D2.1 3.8,89.61 v3.8,96
  Top 0.305: v36.1,19.1 34.7,20.5 v28.5,20.5 28.4,20.6 18,20.6 v17.05,19.65 17.1,19.6 17.1,17.2 16.6,16.7 v16.6,8.7 | v17.9,56.4 17.4,56.9 v10.6,56.9 12.15,58.45 12.15,62.95 v14.1,64.9 13.08,63.88 | v20.76,52.7 29.9,52.7 v30.8,53.6 31.9,54.7 31.9,62.62 30.73,63.8 30.73,73.22 v30.9,73.4 30.93,73.42 30.93,82.91 29.32,84.52 27.4,84.52 26.58,83.7 26.58,81.54 25.48,80.44 24.54,80.44 v24,79.9
  Top 0.406: P2.1 0.79,81.58 0.79,58.31 v3.6,55.5 v3.6,40.6 3.6,39.1 5.1,37.6 5.1,34.9 1.7,31.5 v1.7,19 | v9,19 16.4,19 v17.05,19.65
  Top 0.508: P2.1 2.27,83.04 C7.- 5.27,83.74 5.27,88.08 D2.1
  Bottom 0.254: IC3.11 19.3,56.8 C25.2 | 30.75,51.1 IC4.6 30.75,50.26 29.2,48.7 C22.2 R38.1 | v3.6,55.5 4.68,54.41 IC5.6 4.68,51.48 3.9,50.7 C23.2 | TR1.3 21,40.1 20.5,39.6 17.8,39.6 16.07,41.33 TR2.3 6.54,40.06 4.14,40.06 v3.6,40.6 | v9,19 9,21 9.5,21.5 C20.2 | R16.1 2.6,22.1 1.7,21.2 v1.7,19 | R15.1 28.4,20.6 v28.5,20.5 | 14,25.9 R23.1 14.05,26.2 v15.4,26.2 | R10.2 31.65,15.85 33.2,17.4 33.2,18.4 33.75,18.95 U1.2 35.95,18.95 v36.1,19.1 36.5,18.7 C14.2 | v3.8,96 10.55,96 R73.1 | R55.1 14.05,63.65 14.05,64.85 v14.1,64.9 | IC2.4 17.08,19.62 v17.05,19.65 | IC1.4 14.53,7.47 C8.2
  Bottom 0.305: v17.9,56.4 18.3,56.8 19.3,56.8 | C25.2 19.55,56.7 | v30.8,53.6 30.75,53.55 30.75,51.1 | IC3.11 19.3,54.16 v20.76,52.7 | v3.6,55.5 3.69,55.59 6.11,55.59 6.31,55.79 7.51,55.79 8.62,56.9 v10.6,56.9 | v24,79.9 23.52,80.38 IC7.3 21.18,80.38 20.5,79.7 20.5,78.31 18.69,76.5 17.2,76.5 16.6,75.9 R61.1 | IC6.6 30.9,71.22 v30.9,73.4 | v16.6,8.7 17.08,8.22 IC1.4
  Bottom 0.406: v1.7,19 U2.2 v9,19 | C20.2 9.47,22.62
FEEDBACK  (via drill 0.4)
  Top 0.254: v24.1,19.7 26.5,19.7 27.6,18.6 27.6,9.55 v28.25,8.9
  Bottom 0.254: R7.2 C12.2 27.2,11.5 28.25,10.45 v28.25,8.9 R2.1 | R2.1 27.6,7.15 | IC1.1 18.43,5.53 19.65,6.75 IN2.P2 20.07,9.1 25.9,9.1 27.85,7.15 R2.1
FF_Q1  (via drill 0.4)
  Top 0.254: v31.7,90.89 29.59,88.78 23.78,88.78 21.6,86.6 16,86.6 | v16,90.3 16,86.6 | 16,86.6 16,82.69 v15.81,82.5
  Bottom 0.254: U3.15 31.67,90.92 v31.7,90.89 | v16,90.3 16.03,90.33 U4.9 | v15.81,82.5 16.3,82.5 16.73,82.07 IC7.16
FF_Q2  (via drill 0.4)
  Top 0.254: v23.8,81.7 23.9,81.8 23.9,85 24.9,86 31.7,86 v37.3,91.6
  Bottom 0.254: U3.1 37.27,91.58 v37.3,91.6 | v23.8,81.7 22.59,81.7 IC7.1 20.69,81.67 20.2,82.17 17.88,82.17 13.65,86.4 13.65,90.95 14.6,91.9 16,91.9 U4.10
FREQ_CTRL  (via drill 0.4)
  Top 0.254: v19.1,33.1 24.1,33.1 24.44,33.44 24.9,33.44 | v13.9,33.1 15.01,33.1 17.64,35.73 17.64,41.46 v13.9,45.2 | v36,31.4 33.96,33.44 24.9,33.44 | v24.9,28.3 24.9,33.44
  Bottom 0.254: v19.1,33.1 v13.9,33.1 | R43.2 R44.2 12.7,46.4 v13.9,45.2 | v24.9,28.3 24.85,28.25 Q1.3 | v36,31.4 34.8,32.6 34.8,34.2 33,35.99 33,41.2 38.6,46.8 38.6,65.5 38.02,66.08 R56.2 R59.2
GND  (via drill 0.4, 0.6)
  Bottom 0.254: U3.8 U3.7
  Bottom 0.813: POWER!.6 POWER!.5 | POWER!.5 POWER!.7 POWER!.8 POWER!.6 | POWER!.5 POWER!.3 POWER!.4 POWER!.6
  other vias: 3.82,80.38 2.45,72.02 7.55,77.77 7.52,80.37 11.2,80.4 11.18,77.84 24.2,24.6 20.62,45.97 5.3,21.2 10,67.6 11.3,71.9 2.3,50.2 1.4,33.8 1.5,4 37.8,4 25.4,1.9 13.2,1.9 37.44,29.79 28.5,43 36.3,73.8 8.9,51.3 11.9,32.9 27.8,87.2 37.7,86.8 25.7,84.8 13.3,104.9 1.6,104.4 6.3,94.8 1.4,90.4 13.2,96.6 11.7,87.7 38.2,44 22.9,40.6 27.9,40.1 29.4,39.1 14.5,39.1 9.8,27.5 27,28.3 30.9,18.9 38.2,39.8 38.2,34.1 35,14.8 36,13.5 26,15.1 26.1,17.5 22.9,19.7 12.8,54.4 1.8,42.7 9.8,40.2 17.1,50.9 21.3,50.9 29.6,54.7 28.6,59.3 25.3,61.9 27.9,62.7 18.4,64.7 26.8,69.1 24.6,71.4 33.5,104.2 28.3,15.1 29.7,10.7 26.6,10.2 8.9,45.6 10.6,60.8 15,88.2 20.1,97.5 14.1,34.3 16.1,21.4 23,75.8
  pour Top (rank 3): -0.4,-0.1 39.3,-0.1 39.3,106.7 -0.4,106.7
  pour Bottom (rank 3): -0.4,-0.1 39.3,-0.1 39.3,106.7 -0.4,106.7
LED_BLU  (via drill 0.4)
  Top 0.254: v19.9,93.4 19.9,88.48 LED1.BLU
  Bottom 0.254: v19.9,93.4 18.5,93.4 17.43,94.47 U4.14 14.87,94.47 14.4,94 14.4,93 14.87,92.53 U4.11
LED_GRN  (via drill 0.4)
  Top 0.254: v20.2,94.9 20.65,94.45 20.65,89 LED1.GRN
  Bottom 0.254: v20.2,94.9 20.43,95.13 U4.2
LED_RED  (via drill 0.4)
  Top 0.254: LED1.RED 17.75,89.4 18.2,89.86 v18.2,92.2 v18.2,95.4
  Bottom 0.254: v18.2,95.4 18.59,95.79 U4.1 | U4.5 20.97,93.17 20,92.2 v18.2,92.2
N$1  (via drill 0.6)
  Top 0.508: v2.02,80.36 2.19,80.19 P1.2
  Bottom 0.508: POWER!.10 4.87,74.1 2.5,74.1 2.02,74.58 v2.02,80.36
  Bottom 0.813: POWER!.10 POWER!.9
N$2  (via drill 0.6)
  Top 0.508: v2,88.6 2,85.63 P2.2
  Bottom 0.508: POWER!.2 4.85,84.1 2.7,84.1 2,84.8 v2,88.6
  Bottom 0.813: POWER!.2 POWER!.1
N$3
  Bottom 0.254: IN1.P3 6.6,3.1 8.95,5.45 R1.1
N$4
  Bottom 0.254: R1.2 10.9,10.35 R4.1 C10.2 10.2,11.65 R3.2 8.5,14.1 9.14,14.74 12.64,14.74 15.18,17.27 IC2.2
N$5  (via drill 0.4)
  Top 0.254: IN2.P3 17.75,3.8 3.1,3.8 1,5.9 1,31.8 4.4,35.2 4.4,37.4 v2.4,39.4 | LEVEL_1.P$1 9.1,31.5 8,32.6 v8,39.6
  Bottom 0.254: v2.4,39.4 2.6,39.6 v8,39.6
N$6  (via drill 0.4)
  Top 0.254: LEVEL_1.P$2 6.6,28.5 6.36,28.26 5.21,28.26 4.05,27.1 v3.5,27.1
  Bottom 0.254: 8.4,11.55 R3.1 8.5,8.5 7.6,7.6 3.4,7.6 0.7,10.3 0.7,24.9 2.9,27.1 v3.5,27.1
N$7
  Bottom 0.254: R4.2 C10.1 | R4.2 12.3,13.35 R5.1 | R4.2 12.43,13.57 12.57,13.57 | R4.2 12.2,13.65 15.17,16.62 IC2.1 17.98,16.62 R13.2
N$8
  Bottom 0.254: R5.2 C11.1 R6.2 17.6,15.05 21.13,18.57 IC2.5
N$9  (via drill 0.4)
  Top 0.254: v31,16.7 30.8,16.5 30.8,14.1 31.5,13.4 34.6,13.4 37.4,16.2 37.4,28 36.75,28.65 36.75,33.25 27.5,42.5 v20.7,42.5
  Bottom 0.254: v31,16.7 25.9,16.7 25.05,15.85 R9.2 23.48,17.27 IC2.7 | v20.7,42.5 14.7,42.5 11.28,45.92 10.32,45.92 R35.1 9.6,46.65 9.6,48.3 9.1,48.8 7.46,48.8 6.61,47.95 R41.1
N$10  (via drill 0.4)
  Top 0.254: v36.1,53.8 36.1,53.35 33.24,50.49 33.24,46.44 29.2,42.4 29.2,41.5 32.07,38.63 32.07,38.57 37.21,33.44 37.21,31.9 38.14,30.96 38.14,12.69 33.61,8.16 27.26,8.16 v25.2,10.22
  Bottom 0.254: C17.2 R14.1 24.8,17.65 R9.1 23.85,17.55 23.48,17.93 IC2.6 21.12,17.93 20.6,17.4 20.6,16.4 21.3,15.7 21.3,14.12 v25.2,10.22 | v36.1,53.8 33.3,53.8 32.02,55.08 IC4.12
N$11
  Bottom 0.254: R41.2 R42.2 8.3,50.4 7.22,51.48 IC5.4
N$12
  Bottom 0.254: IC5.1 11.04,51.94 10.1,51 10.1,50.05 R43.1
N$13
  Bottom 0.254: C1.1 6.21,45.99 5.8,46.4 5.1,47.1 5.1,50.4 5.96,51.26 IC5.5 5.96,54.76 6.5,55.3 7.7,55.3 8.43,56.03 Q4.3
N$14
  Bottom 0.254: IC5.13 7.2,58.73 R52.2 R53.2
N$15  (via drill 0.4)
  Top 0.254: 29.9,44.18 20.42,44.18 19.01,42.77 19.01,35.06 18.07,34.12 18.07,32.75 18.7,32.13 22.63,32.13 24.04,30.71 24.04,26.34 v23.1,25.4 | 29.9,44.18 30.18,44.18 | 29.9,44.18 30.33,44.18 32.79,46.63 32.79,50.68 35.2,53.09 v35.2,55
  Bottom 0.254: R50.2 IC4.13 33.3,55.3 33.6,55 v35.2,55 | R50.2 | v23.1,25.4 R13.1 | R50.2 31.8,62.64 31.8,63.5 30.66,64.64 22.81,64.64 21.55,65.9 12.6,65.9 11.8,65.1 R54.2
N$16
  Bottom 0.254: R51.1 IC4.16
N$17
  Bottom 0.254: R15.2 C17.1 R14.2 23.95,22.6 22,22.6 21.3,23.3 21.3,25.9 24.4,29 26.62,29 27.32,29.7 Q3.1 28.05,30.55 29.55,32.05 R25.1 R26.1
N$18
  Bottom 0.254: Q4.1 13.68,59.68 14.1,60.1 R55.2 12.6,61.95 R54.1 11.25,61.95 10.4,62.8 8.05,62.8 R52.1
N$19
  Bottom 0.254: IC5.16 11.04,58.47 12.4,57.1 15.3,57.1 15.8,56.6 15.8,55 12.7,51.9 R44.1
N$20
  Bottom 0.254: RES.P$1 R73.2
N$21  (via drill 0.4)
  Top 0.254: v26.2,53.9 20.5,53.9 19.9,53.3 v19.9,51.51 v19.91,51.5 | v18.2,51.7 11.55,51.7 7,56.25 v7,56.8
  Bottom 0.254: C3.1 6.7,65.4 5.96,64.66 IC5.12 5.96,57.84 v7,56.8 | Q3.3 26.37,34.38 25.94,34.81 25.94,38.06 25.1,38.9 25.1,41.7 26.44,43.04 26.44,53.66 v26.2,53.9 | v19.91,51.5 19.71,51.7 v18.2,51.7
N$22  (via drill 0.4)
  Top 0.254: v33.68,40.4 33.68,42.88 v33.7,42.9 | v29.3,61.7 29.47,61.87 29.47,75.13 30.44,76.1 30.44,82.71 29.12,84.03 27.6,84.03 27.07,83.5 27.07,81.34 24.53,78.8 C5.+
  Bottom 0.254: R8.1 29.75,12.45 31.4,10.8 34.6,10.8 38.6,14.8 38.6,32.9 38.1,33.4 36.24,33.4 33.46,36.19 33.46,40.17 v33.68,40.4 | v33.7,42.9 31.8,44.8 28.8,44.8 28.3,45.3 28.3,49.2 27.4,50.1 27.4,59.8 v29.3,61.7
N$23  (via drill 0.4)
  Top 0.254: v22.7,10.2 22.7,13.4 v23.5,14.2
  Bottom 0.254: R8.2 C12.1 R7.1 23.55,14.15 v23.5,14.2 | v22.7,10.2 22.1,10.8 19.2,10.8 18.15,9.75 18.15,8.8 18.8,8.15 18.8,6.7 18.27,6.17 IC1.2
N$24
  Bottom 0.254: R77.2 C31.1 31.6,103.1 32.4,102.3 32.4,94.6 31.08,93.28 D6.A 27.7,93.32 27.7,94.2 27.35,94.55 R74.2
N$25  (via drill 0.4)
  Top 0.254: v29.7,82 29.99,81.71 29.99,76.29 29.01,75.32 29.01,65.61 26.6,63.2 16.4,63.2 14.55,61.35 14.55,59.85 15.4,59 v17.1,59
  Bottom 0.254: R65.1 R64.2 R63.1 29.35,81.65 v29.7,82 | IC3.8 16.4,55.57 16.4,57.5 17.1,58.2 v17.1,59
N$26
  Bottom 0.254: 30.93,68.71 R57.1 R58.2 IC6.4
N$27
  Bottom 0.254: R68.2 R67.2 27.95,85.45 27.14,86.26 D5.A 24.54,86.26 D4.C
N$28  (via drill 0.4)
  Top 0.254: v18.2,52.8 18.2,53.4 20.4,55.6 20.4,57.2 19.3,58.3 15.45,58.3 14.09,59.66 14.09,61.54 16.21,63.66 26.3,63.66 28.56,65.91 28.56,75.51 29.53,76.48 29.53,80.87 v28.4,82
  Bottom 0.254: R69.2 18,86.05 C29.1 R70.2 21.95,84.4 23.5,84.4 23.86,84.04 D4.A 24.54,84.06 D5.C 27.4,84.06 28.4,83.06 v28.4,82 | IC3.10 18.6,54.57 18.6,53.2 v18.2,52.8
N$29
  Bottom 0.254: 33.33,77.47 IC6.13 33.33,78.03 34.15,78.85 R65.2 R66.2
N$30
  Bottom 0.254: R37.2 R39.2 33.3,48.66 IC4.4
N$31
  Bottom 0.254: R56.1 38.02,69.82 38.6,70.4 38.6,75.4 37.7,76.3 IC6.16
N$32  (via drill 0.4)
  Top 0.254: v32,74.2 32.06,74.26 C6.1
  Bottom 0.254: IC6.12 32.05,74.25 v32,74.2 | Q6.3 34.16,82.1 C6.1
N$33  (via drill 0.4)
  Top 0.254: v33.7,45.5 33.7,50.3 36.9,53.5 36.9,56 35.7,57.2 35.7,63.14 v35.04,63.8 35.04,81.27 33.4,82.91 v33.4,83.1
  Bottom 0.254: R38.2 R39.1 33.7,46.55 v33.7,45.5 | R68.1 31.45,83.7 32.5,83.7 33.67,84.87 Q6.1 33.78,83.48 v33.4,83.1 | v35.04,63.8 35.04,64.06 32.92,66.18 32.1,66.18 31.27,67.01 R57.2
N$34
  Bottom 0.254: R40.1 37.2,51.52 IC4.1
N$35  (via drill 0.4)
  Top 0.254: v24.83,77.9 24.93,78 v26.3,78 | v31.65,49.8 31.87,49.58 31.87,47.01 29.95,45.09 16.81,45.09 15.6,46.3 v15.6,47.41 | v19.8,75.8 19.8,73.1 18.6,71.9 18.6,66.69 13.64,61.73 13.64,59.47 15.61,57.5 v17.9,57.5
  Bottom 0.254: R64.1 31.14,79.63 28.13,79.63 27.4,78.9 27.3,78.9 | C28.2 27.3,78.9 | 24.8,77.2 24.8,76 23.76,74.96 20.91,74.96 20.6,74.65 R62.1 18.5,74.75 18.5,75.6 18.7,75.8 v19.8,75.8 | 24.8,77.2 24.83,77.23 v24.83,77.9 24.8,77.87 24.8,77.2 | v26.3,78 27.2,78.9 27.3,78.9 | IC4.5 32.02,50.18 v31.65,49.8 | IC3.9 18,55.01 | IC3.9 18,55.26 16.86,56.4 16.86,57.21 17.15,57.5 v17.9,57.5 | IC3.9 18,53.9 15.6,51.5 v15.6,47.41
N$36  (via drill 0.4)
  Top 0.254: v12.7,77.8 12.7,68.3 5.6,61.2 5.6,57 11.6,51 v14.6,51 v14.61,50.99 | v12.7,80.4 13.32,81.02 13.32,93.98 12.3,95 9,95 8.1,94.1 RES.P$2
  Bottom 0.254: v12.7,80.4 v12.7,77.8 | R36.2 15.4,46.35 14.61,47.14 v14.61,50.99
N$37
  Bottom 0.254: 37.13,70.31 IC6.1 37.13,69.33 36.5,68.7 36.49,68.71 R59.1
N$38
  Bottom 0.254: C28.1 26.35,80.55 25.6,79.8 25.6,75.8 24.3,74.5 21.1,74.5 20.68,74.08 Q5.1 18.44,72.99 R62.2 R61.2 R60.1
N$39  (via drill 0.4)
  Top 0.254: v32,73 32,65.14 C2.1
  Bottom 0.254: IC6.5 32.05,72.94 v32,73 | C2.1 23,65.1 21.6,66.5 21.6,70.76 Q5.3
N$40
  Bottom 0.254: 14.9,22.55 R19.1 15.2,22.45 15.2,20.2 14.23,19.23 14.23,16.97 12.45,15.2 7.04,15.2 RES_CV.P3
N$41  (via drill 0.4)
  Top 0.254: v18.3,19.1 18.3,8.7 18.9,8.1 v20.79,8.1
  Bottom 0.254: 17.36,24.44 D3.C | D3.C 15.09,24.44 R19.2 R18.1 | D3.C 18.3,23.4 v18.3,19.1 | v20.79,8.1 20.79,7.41 21.4,6.8 22.89,6.8 IC1.6
N$42  (via drill 0.4)
  Top 0.254: v15,18.1 15,10.8 v12.7,8.5
  Bottom 0.254: R17.2 13,22.65 R18.2 14.05,23.5 16.1,23.5 17.26,22.34 D3.A 17.26,21.06 15,18.8 v15,18.1 | IC1.7 21.07,6.17 18.8,3.9 14.3,3.9 12.7,5.5 v12.7,8.5
N$43  (via drill 0.4)
  Top 0.254: v14.36,20.94 13.56,21.74 13.56,30.9 18.1,35.44 18.1,42.7 v17.5,43.3 14,46.8 14,47.6 14.9,48.5 15.7,48.5 15.9,48.5 v16.9,47.5
  Bottom 0.254: v14.36,20.94 v14.35,20.95 R11.1 13.18,20.93 C16.2 11.3,20.98 R17.1 | v17.5,43.3 17.4,43.4 R36.1 | IC3.6 18,48.1 17.4,47.5 v16.9,47.5
N$44
  Bottom 0.254: R30.1 7.4,35.4 6.8,36 TR2.2
N$45  (via drill 0.4)
  Top 0.254: v10,20 13.1,23.1 v13.1,39.1 13.1,47.8 14.6,49.3 v16.5,49.3
  Bottom 0.254: R11.2 11.37,19.25 C16.1 10.58,20 v10,20 | v16.5,49.3 16.83,49.3 IC3.7 | R29.1 6.35,33 8,33 8.4,33.4 8.4,37.8 9.7,39.1 v13.1,39.1
N$46
  Bottom 0.254: Q2.5 14.89,30.61 15.1,30.4 15.1,29.05 R23.2 12.55,27.95 10.4,25.8 8.1,25.8 6,27.9 3.5,27.9 2.4,29 2.4,30.95 R28.2 R29.2 R30.2
N$47
  Bottom 0.254: Q2.4 13.46,31.26 13.1,30.9 13.1,30.25 12.81,29.96 Q2.1 11.34,29.96 10.6,30.7 10.6,33.3 10.05,33.85 R31.2
N$48  (via drill 0.4)
  Top 0.254: v8,21 10.35,21 12.64,23.29 12.64,28.36 12.3,28.7 v12.3,28.8
  Bottom 0.254: R16.2 C19.2 5.12,23.63 7.27,23.63 8,22.9 v8,21 7.91,20.91 U2.4 | v12.3,28.8 13.46,29.96 Q2.6
N$49  (via drill 0.4)
  Top 0.254: v3.8,18 3.4,18.4 v3.4,19.9 3.4,25.8 5.4,27.8 7.8,27.8 v7.82,27.82
  Bottom 0.254: C19.1 4.4,20.9 v3.4,19.9 | v3.8,18 3.85,18.05 U2.1 | R31.1 9.18,32.15 7.82,30.79 v7.82,27.82 7.8,27.8
N$50  (via drill 0.4)
  Top 0.254: v36,32.5 34.6,33.9 v23.9,33.9 | v37.9,32.5 38.6,31.8 38.6,31.3 38.6,12.5 33.8,7.7 26.3,7.7 v23.8,10.2
  Bottom 0.254: v37.9,32.5 v36,32.5 | FM_1.P$1 22.2,29.85 R32.2 23.05,32.15 23.9,33 v23.9,33.9 | CV1.P3 19.65,14.52 23.8,10.37 v23.8,10.2
N$51
  Bottom 0.254: R32.1 22,34.05 22,43.25 R34.2 22.05,46.45 20.6,47.9 IC3.2 20.6,48.39
N$52  (via drill 0.4)
  Top 0.254: v20.71,43.49 20.57,43.49 19.47,42.4 19.47,34.43 v19.7,34.2
  Bottom 0.254: IC3.3 19.95,47.9 21.59,46.26 21.59,44.38 v20.71,43.49 | v19.7,34.2 20.4,33.5 20.4,31.7 19.65,30.95 FM_1.P$2
N$53
  Bottom 0.254: IC3.1 21.32,48.85 R45.2 23.2,45.3 23.75,44.75 R34.1
N$54  (via drill 0.4)
  Top 0.254: v27.62,48.4 25.2,50.82 v25.2,51.8
  Bottom 0.254: R48.1 R49.2 24.2,58.25 24.2,56.35 | C24.2 20.6,55.95 IC3.13 20.6,54 22.1,52.5 22.1,50.7 22.25,50.55 R45.1 | R45.1 R46.2 25.2,50.65 v25.2,51.8 | R45.1 23.2,54.4 24.2,55.4 24.2,56.35 | 24.2,56.35 R47.1 | R27.1 32.5,35.05 32.5,41.5 29.66,44.34 28.61,44.34 27.62,45.34 v27.62,48.4
N$55
  Top 0.254: CV2.P3 33.95,14.76 36.9,17.7 36.9,27.8 35.2,29.5 FM_2.P$1
N$56
  Bottom 0.254: FM_2.P$2 33.8,30.9 R27.2
N$57
  Bottom 0.254: FREQ.P$2 21.05,59.35 R48.2
N$58  (via drill 0.4)
  Top 0.254: v24.27,39.19 v21.23,39.19 v21.22,39.18
  Bottom 0.254: R47.2 25.85,55.35 25.3,54.8 25.3,53.4 25.99,52.71 25.99,43.23 24.64,41.89 24.64,39.56 v24.27,39.19 | 20.18,37.98 TR1.2 20.98,37.98 21.22,38.22 v21.22,39.18
N$59  (via drill 0.4)
  Top 0.254: v22.7,55 22.7,58.6 23.7,59.6 v25.9,59.6
  Bottom 0.254: IC3.14 22.75,56.12 C24.1 | 22.75,56.45 C24.1 | R33.2 26.4,41.9 26.9,42.4 26.9,58 26.6,58.3 R49.1 25.9,58.35 v25.9,59.6 | C24.1 22.7,56.35 v22.7,55
N$60  (via drill 0.4)
  Top 0.254: v30.27,27.66 30.46,27.85 v34.85,27.85 | v28.4,32.3 28.5,32.2 v28.5,29.9
  Bottom 0.254: R20.2 34.82,24.38 35.4,23.8 37.4,23.8 38.1,24.5 38.1,26.9 37.15,27.85 v34.85,27.85 | v30.27,27.66 v30.26,27.65 R22.2 28.5,27.85 v28.5,29.9 | R33.1 26.4,38 26.4,35 28.4,33 v28.4,32.3
N$61
  Bottom 0.254: R20.1 34.78,26.67 34.75,26.7 Q1.5 | R20.1 R21.1 | R20.1 33.89,27.6 R24.1
N$62
  Bottom 0.254: R21.2 35.7,25.9 35.49,25.9 35.49,25.89 34.15,25.89 34.15,25.9 33.5,25.9 33.16,26.24 30.64,26.24 30,25.6 28.85,25.6 R22.1
N$63  (via drill 0.4)
  Top 0.254: v27.2,25.2 29.33,23.07 v31.36,23.07
  Bottom 0.254: R10.1 29.95,18 U1.4 32.9,19.06 32.9,20.12 32.4,20.62 31.7,20.62 | 31.7,20.62 29.78,20.62 29.4,21 29.4,23.6 29.6,23.8 29.95,23.8 30.18,23.57 C18.2 30.68,23.07 v31.36,23.07 31.3,23.13 | 31.7,20.62 31.78,20.62 | Q1.6 27.2,25.6 v27.2,25.2
N$64
  Bottom 0.254: 35.7,22.35 R12.1 34.75,22.55 33.7,23.6 33.3,23.6 31.8,23.6 30.9,24.5 25.45,24.5 24.85,25.1 Q1.1 25.65,26.05 25.8,26.2 25.8,27.2 25.95,27.35 Q1.4
N$65
  Bottom 0.254: C18.1 30.95,21.75 31.6,21.1 32.7,21.1 32.95,20.85 R12.2 | 35.65,21.1 R12.2 | R12.2 35.9,20.2 35.6,19.9 U1.1
N$66
  Bottom 0.254: R77.1 25.54,105.11 IC8.1
N$67
  Bottom 0.254: IC8.3 23.93,102.57 25.3,101.2 R76.2 C30.1 25.65,99.1 R75.2
N$68  (via drill 0.4)
  Top 0.254: v38.3,89.6 38.56,89.86 38.56,92.39 36.79,94.16 28.8,94.16 20,102.96 v20,103.8
  Bottom 0.254: U3.12 32.61,88.97 33.26,89.62 U3.4 35.59,89.6 v38.3,89.6 | v20,103.8 22.73,103.8 IC8.2
N$70  (via drill 0.4)
  Top 0.254: v37.3,90.3 38.1,91.1 38.1,92.2 36.6,93.7 28.6,93.7 21,101.3 v20.1,101.3
  Bottom 0.254: U3.3 37.27,90.28 v37.3,90.3 | v20.1,101.3 IC8.4
N$71
  Bottom 0.254: R76.1 27.65,101.5 SW1.A2 SW1.A1
N$72
  Bottom 0.254: U3.13 31.73,89.62 33,90.9 35.55,90.9 U3.2
N$73
  Bottom 0.254: 26.5,90.3 26.6,90.2 R72.2 26.6,91.2 26.2,91.6 24.1,91.6 23.7,92 23.7,94 23.23,94.47 U4.3
N$74
  Bottom 0.254: R71.2 20.78,90.05 20.75,90.05 18.55,90.05 17.52,91.08 17.52,93.31 17,93.83 U4.13
OUT2A  (via drill 0.4)
  Top 0.254: v31.82,40.3 31.82,42.32 33.3,43.8 35.3,43.8 38.6,47.1 38.6,79 35.85,81.75 35.85,83.95 34.26,85.54 25.1,85.54 24.36,84.8 24.36,82.24 v25,81.6
  Bottom 0.254: IC7.4 IC7.5 22.7,79.08 | R26.2 31.9,40.22 v31.82,40.3 | v25,81.6 25,80.6 24.8,80.4 24.69,80.29 24.69,79.39 24.37,79.08 22.7,79.08 | 22.7,79.08 23.48,79.08
OUT2B  (via drill 0.4)
  Top 0.254: v31,41.3 31,42.15 33.11,44.26 35.11,44.26 38.14,47.29 38.14,78.81 35.39,81.56 35.39,83.76 34.43,84.73 34.15,85 32.1,85 | v14.7,79.5 15.6,80.4 22.6,80.4 23.12,80.92 23.7,80.92 25.28,80.92 26.1,81.74 26.1,83.9 27.2,85 32.1,85 | 32.1,85 32.37,85
  Bottom 0.254: R25.2 31,34.65 v31,41.3 | v14.7,79.5 15.12,79.08 IC7.12
OUT4
  Bottom 0.254: IC7.13 17.57,79.72 17.9,79.4 17.9,78.7 17.62,78.42 IC7.11 14.62,78.42 14,77.8 14,75.45 R60.2
OUTPUT
  Bottom 0.254: R2.2 28.25,2.75 29.1,1.9 OUT.P3
RES_CTRL  (via drill 0.4)
  Top 0.254: v15.67,31.84 15.67,32.36 18.56,35.25 18.56,42.96 20.23,44.63 30.14,44.63 32.33,46.82 32.33,50.87 34.4,52.94 34.4,56.3 35.24,57.14 35.24,62.36 v35,62.6
  Bottom 0.254: Q2.3 12.72,31.84 v15.67,31.84 | 37.1,62.9 35.3,62.9 v35,62.6 | R51.2 37.1,62.9 | 37.2,47.1 R40.2 37.65,46.85 38.14,47.34 38.14,62.3 37.54,62.9 37.1,62.9
SUM1  (via drill 0.4)
  Top 0.254: v21.2,75.8 21.2,73.5 v19.6,71.9
  Bottom 0.254: IC7.6 22.57,77.8 | 22.57,77.8 IC7.7 | R35.2 6.05,44.15 0.8,49.4 0.8,66.8 4.4,70.4 18.1,70.4 v19.6,71.9 | 22.57,77.8 21.8,77.8 21.2,77.2 v21.2,75.8
SUM2  (via drill 0.4)
  Top 0.254: v26.3,76.9 v15.1,76.9
  Bottom 0.254: R63.2 28.2,77.7 27.1,77.7 v26.3,76.9 | v15.1,76.9 15.1,77.3 15.57,77.78 IC7.10
SWX1
  Bottom 0.254: R69.1 19.18,82.78 25.1,82.78 25.89,81.99 25.89,80.84 25.14,80.1 25.14,79.2 23.07,77.12 IC7.8
SWY2  (via drill 0.4)
  Top 0.254: v19.3,78.4 18.9,78.8 C5.-
  Bottom 0.254: v19.3,78.4 18.02,77.12 IC7.9

### Text on the board
tPlace: C | uJOVE | Layout & design By: / Shay Shezifi (PLUM) | Based on JOVE By: / SYSTEM 80 | CC BY-NC-SA 4.0
bPlace: www.plum-audio.com | v1.2 | uJOVE | Layout & design By: / Shay Shezifi (PLUM) | Original JOVE By: / SYSTEM 80 | RES / ADJ | FREQ / ADJ | IC2 | IC1 | file: uJOVE7.brd | DO NOT SELL! | CC BY-NC-SA 4.0